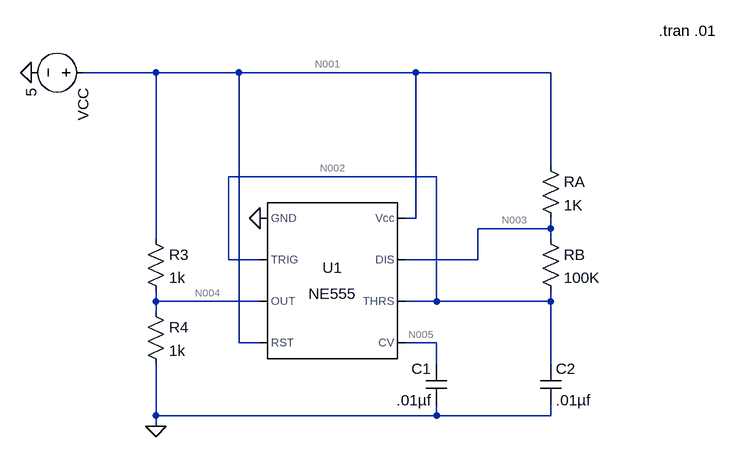
[diagram p0: schematic Draft3.asc]
Draft3.asc, the LTspice schematic file:
Version 4
SHEET 1 980 680
WIRE 112 -160 0 -160
WIRE 240 -160 112 -160
WIRE 512 -160 240 -160
WIRE 720 -160 512 -160
WIRE 720 -16 720 -160
WIRE 544 0 224 0
WIRE 512 64 512 -160
WIRE 512 64 496 64
WIRE 720 80 720 64
WIRE 720 80 608 80
WIRE 112 96 112 -160
WIRE 720 96 720 80
WIRE 224 128 224 0
WIRE 272 128 224 128
WIRE 608 128 608 80
WIRE 608 128 496 128
WIRE 112 192 112 176
WIRE 272 192 112 192
WIRE 544 192 544 0
WIRE 544 192 496 192
WIRE 720 192 720 176
WIRE 720 192 544 192
WIRE 112 208 112 192
WIRE 240 256 240 -160
WIRE 272 256 240 256
WIRE 544 256 496 256
WIRE 544 288 544 256
WIRE 720 288 720 192
WIRE 112 368 112 288
WIRE 544 368 544 352
WIRE 544 368 112 368
WIRE 720 368 720 352
WIRE 720 368 544 368
WIRE 112 384 112 368
FLAG 272 64 0
FLAG -80 -160 0
FLAG 112 384 0
SYMBOL voltage 16 -160 R90
WINDOW 123 0 0 Left 2
WINDOW 39 0 0 Left 2
SYMATTR InstName VCC
SYMATTR Value 5
SYMBOL Misc\\NE555 384 160 R0
SYMATTR InstName U1
SYMBOL cap 560 352 R180
WINDOW 0 24 56 Left 2
WINDOW 3 24 8 Left 2
SYMATTR InstName C1
SYMATTR Value .01µf
SYMBOL res 96 80 R0
SYMATTR InstName R3
SYMATTR Value 1k
SYMBOL res 96 192 R0
SYMATTR InstName R4
SYMATTR Value 1k
SYMBOL res 704 80 R0
SYMATTR InstName RB
SYMATTR Value 100K
SYMBOL cap 704 288 R0
SYMATTR InstName C2
SYMATTR Value .01µf
SYMBOL res 704 -32 R0
SYMATTR InstName RA
SYMATTR Value 1K
TEXT 886 -224 Left 2 !.tran .01

The netlist it stands for:
* Draft3.asc
VCC N001 0 5
XU1 0 N002 N004 N001 N005 N002 N003 N001 NE555  ; pins GND TRIG OUT RST CV THRS DIS Vcc
C1 0 N005 .01µf
R3 N001 N004 1k
R4 N004 0 1k
RB N003 N002 100K
C2 N002 0 .01µf
RA N001 N003 1K
.tran .01
.lib NE555.sub
.backanno
.end

* Results of the author's LTspice run, read from the files saved beside the schematic
* Operating Point, zero values left out:
*   V(n001) = 5 V
*   V(n002) = 4.999 V
*   V(n005) = 3.333 V
*   V(n003) = 5 V
*   V(n004) = 4.97 V
*   I(Ra) = 16.67 nA
*   I(Rb) = 9.998 nA
*   I(R4) = 4.97 mA
*   I(R3) = 29.67 µA
*   I(Vcc) = -6.581 mA
*   Ix(u1:1) = -1.611 mA
*   Ix(u1:2) = 4.999 nA
*   Ix(u1:3) = -4.941 mA
*   Ix(u1:4) = 22.67 µA
*   Ix(u1:6) = 4.999 nA
*   Ix(u1:7) = 6.672 nA
*   Ix(u1:8) = 6.529 mA